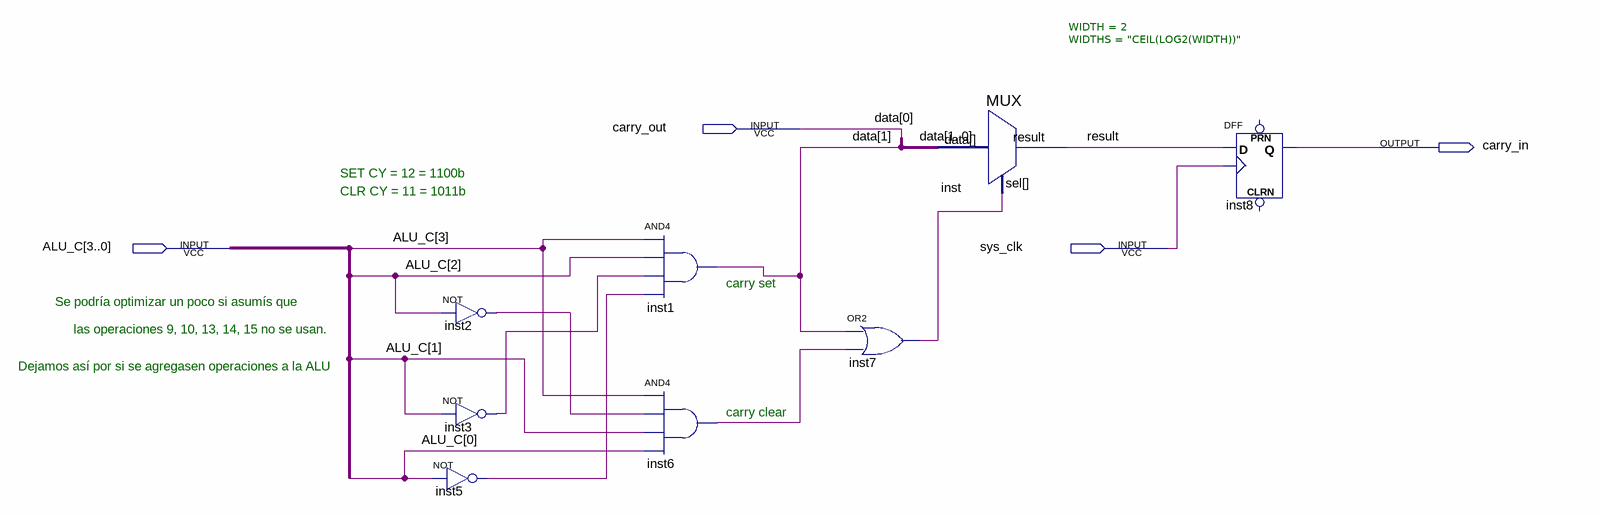
[diagram p0: schematic sheet]
// Quartus schematic CYBlock.bdf as structural Verilog: 8 symbols, 4 pins
module CYBlock (
  input  carry_out,
  input  [3:0] ALU_C,
  input  sys_clk,
  output carry_in
);

  wire inst2_out, inst3_out, inst5_out, inst6_out, inst7_out, result;
  wire [1:1] data;

  not inst2 (inst2_out, ALU_C[2]);
  not inst3 (inst3_out, ALU_C[1]);
  not inst5 (inst5_out, ALU_C[0]);
  and inst1 (data[1], ALU_C[3], ALU_C[2], inst3_out, inst5_out);
  and inst6 (inst6_out, ALU_C[3], inst2_out, ALU_C[1], ALU_C[0]);
  or inst7 (inst7_out, data[1], inst6_out);
  MUX #(.WIDTH(2), .WIDTHS("CEIL(LOG2(WIDTH))")) inst (.data({data[1], carry_out}), .sel(inst7_out), .result(result));
  DFF inst8 (.CLK(sys_clk), .D(result), .Q(carry_in));  // open: CLRN, PRN

  // Other names for the same wires on the sheet: data[0] = carry_out

  // Notes on the sheet:
  //   SET CY = 12 = 1100b
  //   CLR CY = 11 = 1011b
  //   carry set
  //   Se podría optimizar un poco si asumís que 
  //   las operaciones 9, 10, 13, 14, 15 no se usan.
  //   Dejamos así por si se agregasen operaciones a la ALU
  //   carry clear
endmodule
